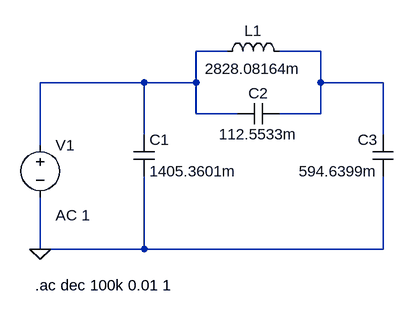
[diagram p0: schematic 3.asc]
3.asc, the LTspice schematic file:
Version 4
SHEET 1 880 740
WIRE 480 -16 432 -16
WIRE 624 -16 560 -16
WIRE 352 32 192 32
WIRE 432 32 432 -16
WIRE 432 32 352 32
WIRE 624 32 624 -16
WIRE 720 32 624 32
WIRE 432 80 432 32
WIRE 496 80 432 80
WIRE 624 80 624 32
WIRE 624 80 560 80
WIRE 352 112 352 32
WIRE 720 112 720 32
WIRE 192 128 192 32
WIRE 192 288 192 208
WIRE 352 288 352 176
WIRE 352 288 192 288
WIRE 720 288 720 176
WIRE 720 288 352 288
FLAG 192 288 0
SYMBOL voltage 192 112 R0
WINDOW 123 24 124 Left 2
WINDOW 39 0 0 Left 0
SYMATTR Value2 AC 1
SYMATTR InstName V1
SYMATTR Value ""
SYMBOL cap 336 112 R0
SYMATTR InstName C1
SYMATTR Value 1405.3601m
SYMBOL cap 560 64 R90
WINDOW 0 0 32 VBottom 2
WINDOW 3 32 32 VTop 2
SYMATTR InstName C2
SYMATTR Value 112.5533m
SYMBOL cap 736 176 R180
WINDOW 0 24 56 Left 2
WINDOW 3 24 8 Left 2
SYMATTR InstName C3
SYMATTR Value 594.6399m
SYMBOL ind 464 0 R270
WINDOW 0 32 56 VTop 2
WINDOW 3 5 56 VBottom 2
SYMATTR InstName L1
SYMATTR Value 2828.08164m
TEXT 184 344 Left 2 !.ac dec 100k 0.01 1

The netlist it stands for:
* 3.asc
V1 N001 0 AC 1
C1 N001 0 1405.3601m
C2 N002 N001 112.5533m
C3 0 N002 594.6399m
L1 N001 N002 2828.08164m
.ac dec 100k 0.01 1
.backanno
.end